# Altium schematic sheet PowerConnector.SchDoc
size A4
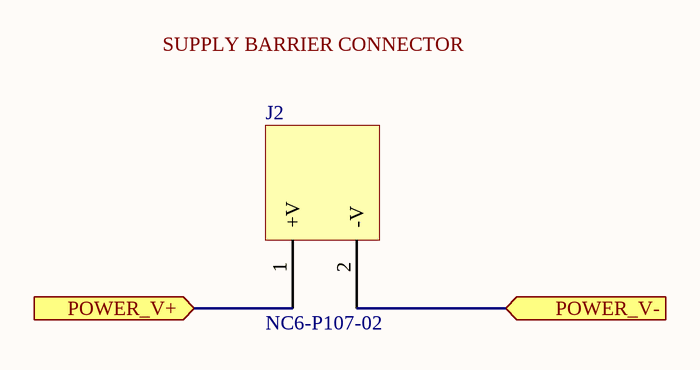
[diagram p0: PowerConnector.SchDoc]

## Parts
J2  NC6-P107-02  [Barrier2POS]

## Ports
POWER_V+ (in), POWER_V- (in)

## Nets
POWER_V+: J2.1(+V) ; port POWER_V+
POWER_V-: J2.2(-V) ; port POWER_V-

## Notes on the sheet
- Labels drawn without touching a wire or pin: SUPPLY BARRIER CONNECTOR

## Library data of the parts
J2 = NC6-P107-02: Bloques de terminal de barrera DUAL .375" 2P 12-22; Value: 2 POS; Supplier: Mouser; Supplier PN: 571-14376644; MPN: NC6-P107-02